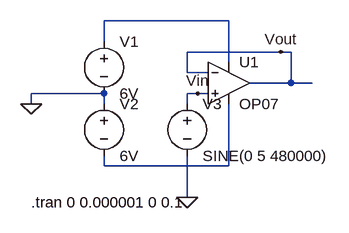
[diagram p0: schematic Volltage follower.asc]
Volltage follower.asc, the LTspice schematic file:
Version 4
SHEET 1 880 680
WIRE 224 64 32 64
WIRE 32 96 32 64
WIRE 304 112 160 112
WIRE 320 112 304 112
WIRE 224 128 224 64
WIRE 160 144 160 112
WIRE 192 144 160 144
WIRE 320 160 320 112
WIRE 320 160 256 160
WIRE 352 160 320 160
WIRE 32 176 -80 176
WIRE 176 176 160 176
WIRE 192 176 176 176
WIRE -80 192 -80 176
WIRE 32 192 32 176
WIRE 160 192 160 176
WIRE 32 288 32 272
WIRE 224 288 224 192
WIRE 224 288 32 288
WIRE 160 336 160 272
FLAG 160 336 0
FLAG 176 176 Vin
FLAG 304 112 Vout
FLAG -80 192 0
SYMBOL voltage 32 80 R0
SYMATTR InstName V1
SYMATTR Value 6V
SYMBOL voltage 32 176 R0
SYMATTR InstName V2
SYMATTR Value 6V
SYMBOL OpAmps\\OP07 224 96 R0
SYMATTR InstName U1
SYMBOL voltage 160 176 R0
WINDOW 123 0 0 Left 0
WINDOW 39 0 0 Left 0
SYMATTR InstName V3
SYMATTR Value SINE(0 5 480000)
TEXT -80 344 Left 2 !.tran 0 0.000001 0 0.1

The netlist it stands for:
* Volltage follower.asc
V1 N001 0 6V
V2 0 N002 6V
XU1 Vin Vout N001 N002 Vout LT1001  ; OP07, pins In+ In- V+ V- OUT
V3 Vin 0 SINE(0 5 480000)
.tran 0 0.000001 0 0.1
.lib LTC.lib
.backanno
.end